# Altium schematic sheet LFO.SchDoc
size A4
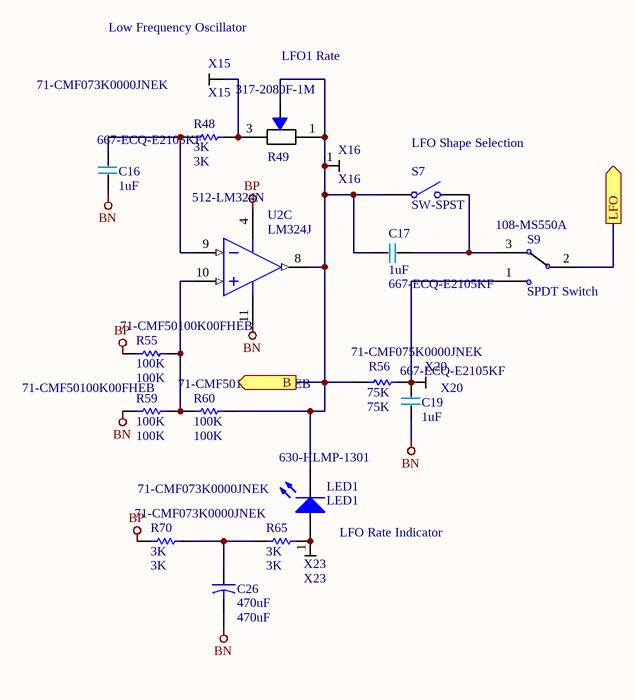
[diagram p0: LFO.SchDoc]

## Parts
C16  Supplier Part Number 1: 667-ECQ-E2105KF  [Cap Film 5]  (hidden comment: 1uF)
C17  Supplier Part Number 1: 667-ECQ-E2105KF  [Cap Film 5]  (hidden comment: 1uF)
C19  Supplier Part Number 1: 667-ECQ-E2105KF  [Cap Film 5]  (hidden comment: 1uF)
C26  470uF  [CAPR5-4X5]
LED1  LED1  Supplier Part Number 1: 630-HLMP-1301  [LED-0]
R48  3K  Supplier Part Number 1: 71-CMF073K0000JNEK  [AXIAL-0.3]
R49  Supplier Part Number 1: 317-2080F-1M  [Potentiometer]  (hidden comment: 1M)
R55  100K  Supplier Part Number 2: 71-CMF50100K00FHEB  [AXIAL-0.3]
R56  75K  Supplier Part Number 1: 71-CMF075K0000JNEK  [AXIAL-0.3]
R59  100K  Supplier Part Number 2: 71-CMF50100K00FHEB  [AXIAL-0.3]
R60  100K  Supplier Part Number 2: 71-CMF50100K00FHEB  [AXIAL-0.3]
R65  3K  Supplier Part Number 1: 71-CMF073K0000JNEK  [AXIAL-0.3]
R70  3K  Supplier Part Number 1: 71-CMF073K0000JNEK  [AXIAL-0.3]
S7  SW-SPST  [SPST-2]
S9  SPDT Switch  Supplier Part Number 1: 108-MS550A  [SPDT Switch]
U2  LM324J  Supplier Part Number 1: 512-LM324N  [J14A]  (part C of 4)
X15  X15  [Pad]
X16  X16  [Pad]
X20  X20  [Pad]
X23  X23  [Pad]

## Ports
B (out), LFO (out)

## Nets
BN: C16.1 C19.1 C26.2 R59.1 U2.11(GND)
BP: R55.1 R70.1 U2.4(V+)
B: C17.2 LED1.2(K) R49.1 R49.2 R56.1 R60.2 S7.1(COMMON) U2.8(OUT3) X16.1 ; port B
LFO: S9.2 ; port LFO
NetC16_2: C16.2 R48.1 U2.9(IN3-)
NetC17_1: C17.1 S7.2(NO) S9.3
NetC19_2: C19.2 R56.2 S9.1 X20.1
NetC26_1: C26.1 R65.1 R70.2
NetLED1_1: LED1.1(A) R65.2 X23.1
NetR48_2: R48.2 R49.3 X15.1
NetR55_2: R55.2 R59.2 R60.1 U2.10(IN3+)

## Notes on the sheet
- (near X15) Low Frequency Oscillator
- LFO1 Rate
- (near S7) LFO Shape Selection
- LFO Rate Indicator

## Library data of the parts
C16 C17 C19 = Cap Film 5: Manufacturer: Panasonic; Manufacturer Part Number: ECQ-E2105KF; Tolerance: 10 %; Type: Metallized Polyester Film Capacitor; Voltage Rating DC: 250 VDC; Capacitance - nF: 1000 nF; Dielectric: Polyester; Lead Diameter: 0.8 mm; Value: 1uF; Supplier 1: Mouser; RoHS: RoHS Compliant; Category: Film Capacitors; Stock 1: 10797; Pricing 1: 1=0.680, 10=0.361, 100=0.268, 500=0.233, 1000=0.198, 2000=0.186, 10000=0.160, 25000=0.157, 50000=0.150 (USD); Capacitance: 1 uF; Height: 15 mm; Length: 18.5 mm; Packaging: Bulk; Product: General Film Capacitors; Series: ECQE(B); Termination Style: Radial; Width: 7.4 mm; Brand: Panasonic; Lead Spacing: 15 mm; Maximum Operating Temperature: + 105 C; Minimum Operating Temperature: - 40 C; Standard Pack Qty: 1000; RoHS - Mouser: Y; Minimum Order Quantity: 1; Reeling: False; ComponentLink1URL: http://www.mouser.com/ds/2/315/ABD0000C179-947645.pdf; ComponentLink1Description: http://www.mouser.com/ds/2/315/ABD0000C179-947645.pdf
C26 = Cap2: Capacitor; Value: 470uF; Published: 23-Sep-2002; PackageReference: CAPR5-4X5; Publisher: Altium Limited; PackageDescription: Capacitor; 2 Leads; Supplier 1: Mouser; Supplier Part Number 1: 667-ECA-1VM471
LED1 = LED0: Typical INFRARED GaAs LED; Manufacturer: Broadcom / Avago; Illumination Color: Red; Lens Color/Style: Tinted, Diffused; Wavelength: 635 nm; LED Size: T-1 (3 mm); Lens Shape: Dome; Luminous Intensity: 3.4 mcd; Viewing Angle: 60 deg; If - Forward Current: 10 mA; Operating Supply Voltage: 1.9 V; Published: 8-Jun-2000; LatestRevisionDate: 08-Jul-2005; LatestRevisionNote: Mech Layer 1 removed.; PackageReference: LED-0; Publisher: Altium Limited; PackageDescription: LED; 2 Leads; Supplier 1: Mouser; Manufacturer Part Number: HLMP-1301; RoHS: RoHS Compliant; Category: Standard LEDs - Through Hole; Stock 1: 32479; Pricing 1: 1=0.370, 10=0.240, 100=0.138, 1000=0.108, 2000=0.090, 10000=0.084, 24000=0.082, 50000=0.079, 100000=0.075 (USD); Package / Case: T-1 (3 mm); Packaging: Bulk; Brand: Broadcom / Avago; Mounting Style: Through Hole; Lens Dimensions: 3 mm; Maximum Operating Temperature: + 100 C; Minimum Operating Temperature: - 40 C; Standard Pack Qty: 2000; Vf - Forward Voltage: 1.9 V; Wavelength/Color Temperature: 635 nm; RoHS - Mouser: Y; Minimum Order Quantity: 1; Reeling: False
R48 R65 R70 = Res1: Resistor; Manufacturer: Vishay / Dale; Manufacturer Part Number: CMF073K0000JNEK; Power Rating: 500 mW (1/2 W); Resistance: 3 kOhms; Temperature Coefficient: 200 PPM / C; Tolerance: 5 %; Voltage Rating: 250 V; Lead Diameter: 0.64 mm; Published: 8-Jun-2000; LatestRevisionDate: 17-Jul-2002; LatestRevisionNote: Re-released for DXP Platform.; PackageReference: AXIAL-0.3; Publisher: Altium Limited; PackageDescription: Axial Device, Thru-Hole; 2 Leads; 0.3 in Pin Spacing; Value: 3K; Supplier 1: Mouser; RoHS: RoHS Compliant; Category: Metal Film Resistors - Through Hole; Stock 1: 1543; Pricing 1: 1=0.450, 25=0.324, 50=0.198, 100=0.147, 500=0.106, 1000=0.082, 2500=0.078, 5000=0.077, 10000=0.075 (USD); Diameter: 2.29 mm; Length: 6.1 mm; Operating Temperature Range: - 55 C to + 175 C; Packaging: Bulk; Product: Metal Film Resistors Controlled Temp Coefficient; Series: CMF Industrial; Termination Style: Axial; Type: Metal Film Resistors, Industrial, Precision; Brand: Vishay / Dale; Standard Pack Qty: 100; RoHS - Mouser: Y; Minimum Order Quantity: 1; Reeling: False; ComponentLink1URL: http://www.mouser.com/ds/2/427/cmfind-239942.pdf; ComponentLink1Description: http://www.mouser.com/ds/2/427/cmfind-239942.pdf
R49 = Potentiometer: My Own; Manufacturer: Alpha (Taiwan); Manufacturer Part Number: RV09AF-40-20K-A16; Power Rating: 50 mW; Resistance: 1 MOhms; Tolerance: 20 %; Voltage Rating: 50 V; Number of Gangs: 1 Gang; Number of Turns: 1 Turn; Shaft Diameter: 6 mm; Shaft Length: 20 mm; Shaft Type: Knurled / Serrated; Supplier 1: Mouser; RoHS: RoHS Compliant; Category: Potentiometers; Stock 1: 740; Pricing 1: 1=1.32, 25=1.11, 50=1.03, 100=0.940, 500=0.790, 1000=0.660, 2500=0.550, 5000=0.500, 10000=0.450 (USD); Operating Temperature Range: - 10 C to + 70 C; Product: Potentiometer; Termination Style: Through Hole; Type: Rotary; Brand: Alpha (Taiwan); Mounting Style: Panel Mount; Standard Pack Qty: 1000; Taper: Audio; RoHS - Mouser: Y; Minimum Order Quantity: 1; Reeling: False; Value: 1M
R55 R59 R60 = Res1: Resistor; Manufacturer Part Number: CMF55100K00FHEK; Brand: Vishay / Dale; Lead Diameter: 0.64 mm; Power Rating: 500 mW (1/2 W); Resistance: 100 kOhms; Temperature Coefficient: 50 PPM / C; Tolerance: 1 %; Voltage Rating: 250 V; Published: 8-Jun-2000; LatestRevisionDate: 17-Jul-2002; LatestRevisionNote: Re-released for DXP Platform.; PackageReference: AXIAL-0.3; Publisher: Altium Limited; PackageDescription: Axial Device, Thru-Hole; 2 Leads; 0.3 in Pin Spacing; Value: 100K; Category: Metal Film Resistors - Through Hole; ComponentLink1Description: http://www.mouser.com/ds/2/427/cmfind-239942.pdf; ComponentLink1URL: http://www.mouser.com/ds/2/427/cmfind-239942.pdf; Diameter: 2.29 mm; Length: 6.1 mm; Manufacturer: Vishay / Dale; Minimum Order Quantity: 1; Operating Temperature Range: - 55 C to + 175 C; Packaging: Bulk; Pricing 1: 1=0.230, 25=0.181, 100=0.132, 500=0.115, 1000=0.099, 2000=0.092, 5000=0.087, 10000=0.082, 25000=0.072 (USD); Product: Metal Film Resistors Controlled Temp Coefficient; Reeling: False; RoHS - Mouser: Y; RoHS: RoHS Compliant; Series: CMF Industrial; Standard Pack Qty: 100; Stock 1: 4041; Supplier 1: Mouser; Supplier Part Number 1: 71-CMF50100K00FHEB; Termination Style: Axial; Type: Metal Film Resistors, Industrial, Precision; Stock 2: 935; Pricing 2: 1=0.770, 10=0.460, 50=0.400, 100=0.287, 500=0.233, 1000=0.168, 2000=0.163, 5000=0.160, 10000=0.153 (USD)
R56 = Res1: Resistor; Manufacturer: Yageo; Manufacturer Part Number: FMP200FRF52-75K; Power Rating: 500 mW (1/2 W); Resistance: 5 kOhms; Temperature Coefficient: 200 PPM / C; Tolerance: 5 %; Voltage Rating: 250 V; Brand: Vishay / Dale; Lead Diameter: 0.64 mm; Published: 8-Jun-2000; LatestRevisionDate: 17-Jul-2002; LatestRevisionNote: Re-released for DXP Platform.; PackageReference: AXIAL-0.3; Publisher: Altium Limited; PackageDescription: Axial Device, Thru-Hole; 2 Leads; 0.3 in Pin Spacing; Value: 75K; Supplier 1: Mouser; RoHS: RoHS Compliant; Category: Metal Film Resistors - Through Hole; Stock 1: 227; Pricing 1: 1=0.320, 25=0.300, 50=0.184, 100=0.116, 500=0.099, 1000=0.076, 2500=0.071, 5000=0.064 (USD); Diameter: 2.29 mm; Length: 6.1 mm; Operating Temperature Range: - 55 C to + 175 C; Packaging: Bulk; Product: Metal Film Resistors Controlled Temp Coefficient; Series: CMF Industrial; Termination Style: Axial; Type: Metal Film Resistors, Industrial, Precision; Standard Pack Qty: 100; RoHS - Mouser: Y; Minimum Order Quantity: 1; Reeling: False; ComponentLink1URL: http://www.mouser.com/ds/2/427/cmfind-239942.pdf; ComponentLink1Description: http://www.mouser.com/ds/2/427/cmfind-239942.pdf
S7 = SW-SPST: Single-Pole, Single-Throw Switch; Published: 24-Mar-1999; LatestRevisionDate: 17-Jul-2002; LatestRevisionNote: Re-released for DXP Platform.; PackageReference: SPST-2; Publisher: Altium Limited; PackageDescription: Switch; 2 Leads; Supplier 1: Mouser; Supplier Part Number 1: 108-MS550K
S9 = SPDT Switch: Manufacturer: Mountain Switch; Actuator: Paddle; Bushing Size: M6; Switch Function: ON - ON; Voltage Rating AC: 125 VAC; Product Status: Not Recommended for New Designs; Supplier 1: Mouser; Manufacturer Part Number: 108-MS550A; RoHS: No; Category: Toggle Switches; Stock 1: 531; Pricing 1: 1=2.15, 50=2.09, 100=2.03, 500=1.97, 1000=1.80, 2000=1.71, 5000=1.63 (USD); Contact Form: SPDT; Contact Plating: Gold; Mounting Type: Bushing; Packaging: Bulk; Series: 108; Terminal Seal: Sealed; Termination Style: Solder Lug; Type: Toggle Switches; Brand: Mountain Switch; Contact Material: Nickel; Mounting Style: Panel; Standard Pack Qty: 100; RoHS - Mouser: N; Minimum Order Quantity: 1; Reeling: False; ComponentLink1URL: http://www.mouser.com/ds/2/221/MS-200272-200731.pdf; ComponentLink1Description: http://www.mouser.com/ds/2/221/MS-200272-200731.pdf
U2 = LM324J: Low Power Quad Operational Amplifier, 14-pin CerDIP; Manufacturer: National Semiconductor; Manufacturer Part Number: LM324N; PackageTopMarking: NSUZXYYTT*LM324J; PowerWise: N; CompType: Amplifiers; High-Reliability: Y; Amplifier Type: High Gain Amplifier; Input Type: Rail-to-Rail; Supply Type: Single, Dual; Brand: ON Semiconductor / Fairchild; Number of Channels: 4 Channel; Shutdown: No Shutdown; CMRR - Common Mode Rejection Ratio: 65 dB; Dual Supply Voltage: +/- 3 V, +/- 5 V, +/- 9 V; Ib - Input Bias Current: 250 nA; Maximum Dual Supply Voltage: +/- 16 V; Minimum Dual Supply Voltage: +/- 1.5 V; Operating Supply Current: 175 uA; Operating Supply Voltage: 3 V to 32 V, +/- 1.5 V to +/- 16 V; Output Current per Channel: 40 mA; Pd - Power Dissipation: 1310 mW; Supply Voltage - Max: 32 V; Supply Voltage - Min: 3 V; Voltage Gain dB: 100 dB; Vos - Input Offset Voltage: 7 mV; DatasheetVersion: Aug-2000; PackageVersion: revJ, Jul-2002; PackageReference: J14A; PackageDescription: Cerdip, .400 x .310in Body, 14 Lead, .300in Centers, .100in Pitch; PartNumber: LM324J; RoHS: N; PinCount: 14; ComponentLink1Description: Manufacturer URL; ComponentLink1URL: http://www.national.com/; ComponentLink2Description: LM324 Datasheet; ComponentLink2URL: http://www.national.com/ds/LM/LM324.pdf; ComponentLink3Description: LM324 Web Page; ComponentLink3URL: http://www.national.com/pf/LM/LM324.html; ComponentLink4Description: J14A Package Page; ComponentLink4URL: http://www.national.com/packaging/folders/j14a.html; Supplier 1: Mouser; Category: Operational Amplifiers - Op Amps; Stock 1: 11024; Pricing 1: 1=0.460, 10=0.380, 100=0.232, 1000=0.179, 2500=0.153, 10000=0.143, 25000=0.135, 50000=0.132 (USD); Height: 3.56 mm (Max); Length: 19.56 mm (Max); Package / Case: DIP-14; Packaging: Tube; Product: Operational Amplifiers; Series: LM324; Technology: Bipolar; Width: 6.6 mm (Max); Mounting Style: Through Hole; Maximum Operating Temperature: + 70 C; Minimum Operating Temperature: 0 C; PSRR - Power Supply Rejection Ratio: 65 dB; Standard Pack Qty: 25; RoHS - Mouser: Y; Minimum Order Quantity: 1; Reeling: False; ComponentLink5URL: http://www.mouser.com/ds/2/308/LM324-1120928.pdf; ComponentLink5Description: http://www.mouser.com/ds/2/308/LM324-1120928.pdf
X15 X16 X20 X23 = Pad